# EAGLE design Regenmesser00 (EAGLE 5.04)
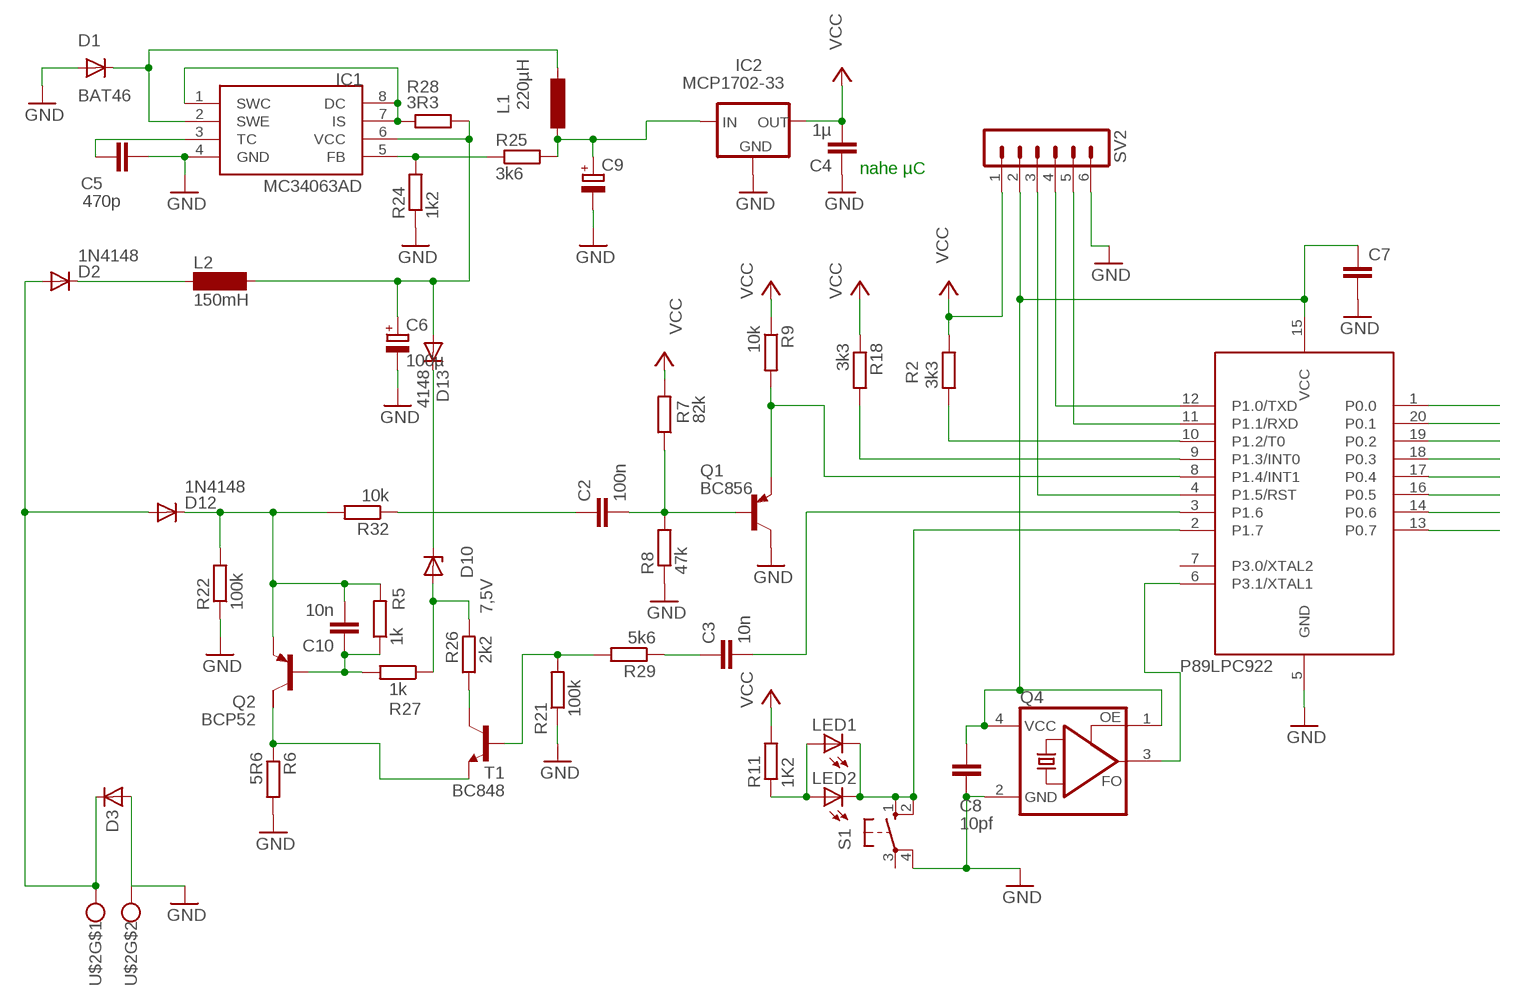
[diagram p0: schematic, sheet 1]

## Parts
C2  100n  C-EUC1206  [C1206]
C3  10n  C-EUC1206  [C1206]
C4  1µ  C-EUC1206  [C1206]
C5  470p  C-EUC1206  [C1206]
C6  100µ  CPOL-EUSANYO_SMD_B6  [SANYO-OSCON_SMD_B6]
C7  C-EUC1206  [C1206]
C8  10pf  C-EUC1206  [C1206]
C9  CPOL-EUSANYO_SMD_A5  [SANYO-OSCON_SMD_A5]
C10  10n  C-EUC1206  [C1206]
D1  BAT46  DIODE-MINIMELF  [MINIMELF]
D2  1N4148  DIODE-MINIMELF  [MINIMELF]
D3  SMAJ40AC  D-SMB  [SMB]
D10  7,5V  ZPD  [MINIMELF]
D12  1N4148  DIODE-MINIMELF  [MINIMELF]
D13  4148  DIODE-MINIMELF  [MINIMELF]
IC1  MC34063AD  [SOIC8]
IC2  MCP1702-33  79LXX  [79LXX]
L1  220µH  L-EU2200-11.43  [2200-11.43]
L2  150mH  SD12-1000  [SD12_1000]
LED1  LEDCHIPLED_1206  [CHIPLED_1206]
LED2  LED3MM  [LED3MM]
Q1  BC856  BC856ALT1SMD  [SOT23-BEC]
Q2  BCP52  FZT753SMD  [SOT223]
Q4  ASFL  [ASF]
R2  3k3  R-EU_M1206  [M1206]
R5  1k  R-EU_R1206  [R1206]
R6  5R6  R-EU_R1206  [R1206]
R7  82k  R-EU_R1206  [R1206]
R8  47k  R-EU_M1206  [M1206]
R9  10k  R-EU_R1206  [R1206]
R11  1K2  R-EU_R1206  [R1206]
R18  3k3  R-EU_R1206  [R1206]
R21  100k  R-EU_R1206  [R1206]
R22  100k  R-EU_M1206  [M1206]
R24  1k2  R-EU_R1206  [R1206]
R25  3k6  R-EU_M1206  [M1206]
R26  2k2  R-EU_M1206  [M1206]
R27  1k  R-EU_R1206  [R1206]
R28  3R3  R-EU_M1206  [M1206]
R29  5k6  R-EU_R1206  [R1206]
R32  10k  R-EU_R1206  [R1206]
S1  10-XX  [B3F-10XX]
SV2  MA06-1  [MA06-1]
T1  BC848  [SOT23]
U1  89LPC922  [DIL20]
U$2  AKL059-02  [AKL3.5X2]

## Nets
A_PUNKT_EIBIN: C2.2 Q1.B R7.1 R8.2
BASE_SEND: R21.2 R29.2 T1.1(B)
BASE_SEND_AMP: C10.1 Q2.1(B) R5.1 R27.2
C_T1: R26.1 T1.3(C)
CURR_SENSE: Q2.2(C) R6.1 T1.2(E)
EIB+: D2.A D3.1(C) D12.A U$2.1
EIB_DC1: C6.+ D13.A IC1.6(VCC) L2.2 R28.2
EIB_SEND: C3.2 U1.3(P1.6)
EIBIN: Q1.E R9.2 U1.8(P1.4/INT1)
GND: C4.1 C5.2 C6.- C7.2 C8.2 C9.- D1.A D3.2(A) IC1.4(GND) IC2.GND Q1.C Q4.2(GND) R6.2 R8.1 R21.1 R22.1 R24.1 S1.4(P1) SV2.6 U1.5(GND) U$2.2
INT0: R18.2 U1.9(P1.3/INT0)
N$2: C3.1 R29.1
N$5: C10.2 D12.C Q2.3(E) R5.2 R22.2 R32.2
N$8: D2.C L2.1
N$19: LED1.A LED2.A R11.1
N$51: D1.C IC1.2(SWE) L1.2
N$52: C5.1 IC1.3(TC)
N$58: D10.C D13.C
N$63: IC1.1(SWC) IC1.7(IS) IC1.8(DC) R28.1
N$77: C2.1 R32.1
OSCCLK: Q4.3(FO) U1.6(P3.1/XTAL1)
P00: U1.1(P0.0)
P01: U1.20(P0.1)
P02: U1.19(P0.2)
P03: U1.18(P0.3)
P04: U1.17(P0.4)
P05: U1.16(P0.5)
P06: U1.14(P0.6)
P07: U1.13(P0.7)
PROG: LED1.C LED2.K(C) S1.1(S) S1.2(S1) U1.2(P1.7)
PWM: R2.2 U1.10(P1.2/T0)
REFERENZ: D10.A R26.2 R27.1
RESET: SV2.3 U1.4(P1.5/RST)
RXD: SV2.5 U1.11(P1.1/RXD)
TXD: SV2.4 U1.12(P1.0/TXD)
VCC: C4.2 IC2.OUT R2.1 R7.2 R9.1 R11.2 R18.1 SV2.1
VCC5V: C9.+ IC2.IN L1.1 R25.2
VCC_FEEDBACK: IC1.5(FB) R24.2 R25.1
VCC_LPC: C7.1 C8.1 Q4.1(OE) Q4.4(VCC) SV2.2 U1.15(VCC)
Unconnected: Q2.4(C/) S1.3(P) U1.7(P3.0/XTAL2)

## Notes on the sheet
- nahe µC
- P89LPC922

## Library data of the parts
C2-C5 C7 C8 C10 = rcl:C-EU: CAPACITOR, European symbol
C6 C9 = rcl:CPOL-EU: POLARIZED CAPACITOR, European symbol
D1 D2 D12 D13 = diode:DIODE-: DIODE
D3 = semicon-smd-ipc:D-: DIODE unfilled
D10 = diode:ZPD: Z DIODE 500 mW
IC1 = mc34063:MC34063
IC2 = v-reg:79LXX: VOLTAGE REGULATOR
L1 = rcl:L-EU: INDUCTOR, European symbol
L2 = inductor-neosid:SD12: INDUCTOR nominal inductance
LED1 LED2 = led:LED: LED OSRAM: - CHIPLED LG R971, LG N971, LY N971, LG Q971, LY Q971, LO R971, LY R971 LH N974, LH R974 LS Q976, LO Q976, LY Q976 LO Q996 - Hyper CHIPLED LW Q18S LB Q993, LB Q99A, LB R99A - SideLED LS A670, LO A670, LY A670, LG A670, LP A670 LB A673, LV A673, LT A673, LW A673 LH A674 LY A675 LS A676, LA A676, LO A676, LY A676, LW A676 LS A679, LY A679, LG A679 - Hyper Micro SIDELED® LS Y876, LA Y876, LO Y876, LY Y876 LT Y87S - SmartLED LW L88C, LW L88S LB L89C, LB L89S, LG L890 LS L89K, LO L89K, LY L89K LS L896, LA L896, LO L896, LY L896 - TOPLED LS T670, LO T670, LY T670, LG T670, LP T670 LSG T670, LSP T670, LSY T670, LOP T670, LYG T670 LG T671, LOG T671, LSG T671 LB T673, LV T673, LT T673, LW T673 LH T674 LS T676, LA T676, LO T676, LY T676, LB T676, LH T676, LSB T676, LW T676 LB T67C, LV T67C, LT T67C, LS T67K, LO T67K, LY T67K, LW E67C LS E67B, LA E67B, LO E67B, LY E67B, LB E67C, LV E67C, LT E67C LW T67C LS T679, LY T679, LG T679 LS T770, LO T770, LY T770, LG T770, LP T770 LB T773, LV T773, LT T773, LW T773 LH T774 LS E675, LA E675, LY E675, LS T675 LS T776, LA T776, LO T776, LY T776, LB T776 LHGB T686 LT T68C, LB T68C - Hyper Mini TOPLED® LB M676 - Mini TOPLED Santana® LG M470 LS M47K, LO M47K, LY M47K Source: http://www.osram.convergy.de - LUMILED® LXK2-PW12-R00, LXK2-PW12-S00, LXK2-PW14-U00, LXK2-PW14-V00 LXK2-PM12-R00, LXK2-PM12-S00, LXK2-PM14-U00 LXK2-PE12-Q00, LXK2-PE12-R00, LXK2-PE12-S00, LXK2-PE14-T00, LXK2-PE14-U00 LXK2-PB12-K00, LXK2-PB12-L00, LXK2-PB12-M00, LXK2-PB14-N00, LXK2-PB14-P00, LXK2-PB14-Q00 LXK2-PR12-L00, LXK2-PR12-M00, LXK2-PR14-Q00, LXK2-PR14-R00 LXK2-PD12-Q00, LXK2-PD12-R00, LXK2-PD12-S00 LXK2-PH12-R00, LXK2-PH12-S00 LXK2-PL12-P00, LXK2-PL12-Q00, LXK2-PL12-R00 Source: www.luxeon.com
Q1 = transistor-pnp:BC856*: PNP Transistror
Q2 = transistor-pnp:FZT753SMD: PNP Transistor
Q4 = crystal:ASF*: CRYSTAL CLOCK OSCILLATORS 5.0 Vdc or 3.3 Vdc - LOW PROFILE ULTRA MINIATURE CERAMIC SURFACE MOUNT Source: http://www.abracon.com/Oscillators/asf1-L-L1.pdf
R2 R5-R9 R11 R18 R21 R22 R24-R29 R32 = rcl:R-EU_: RESISTOR, European symbol
S1 = switch-omron:10-XX: OMRON SWITCH
SV2 = con-lstb:MA06-1: PIN HEADER
T1 = transistor:BC848: NPN TRANSISTOR
U1 = micro-philips:89LPC922
U$2 = con-wago-500:AKL059-02

## Board
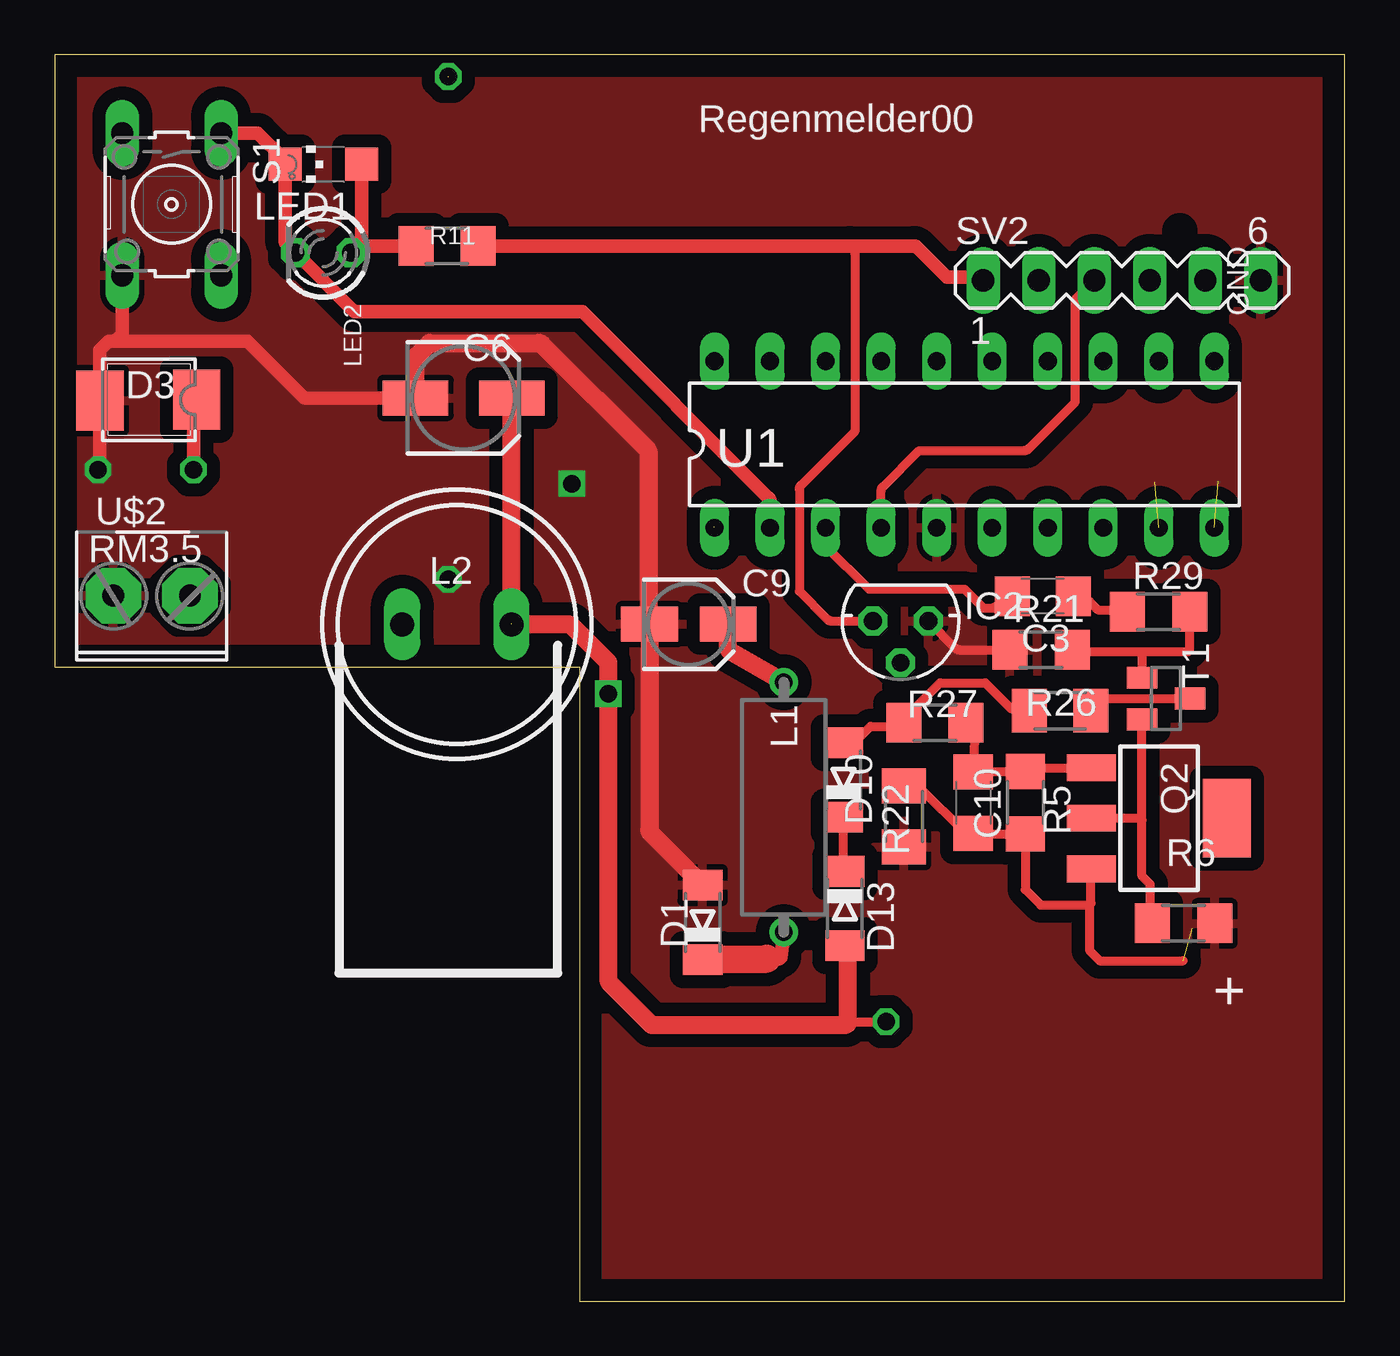
[diagram p1: board, top side]
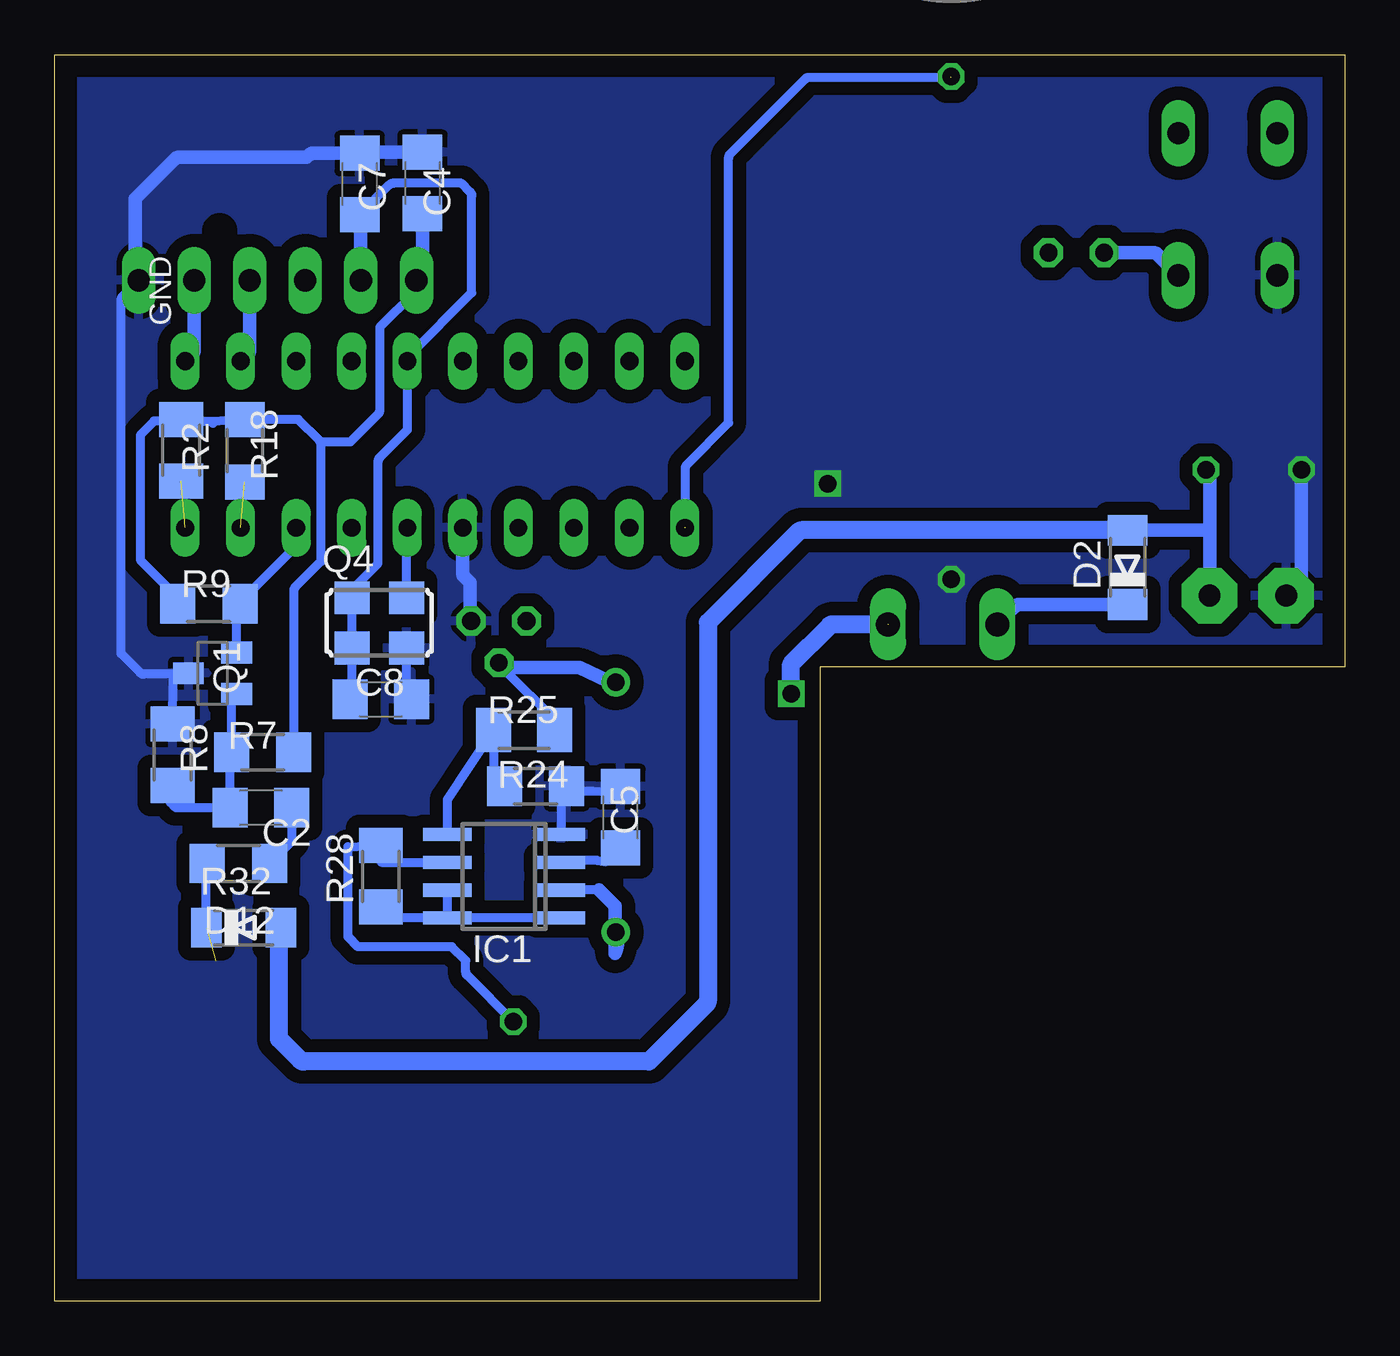
[diagram p2: board, bottom side, seen from below]

Size 59 x 57 mm. Coordinates in mm from the lower left corner, seen from the top.
Outline: 59,0 59,57 0,57 0,29 24,29 24,0 59,0
Copper layers (1*16): Top 0.035mm / dielectric 1.5mm / Bottom 0.035mm
Design rules "default": minimum track width 10mil, minimum drill 24mil, track to track 8mil, track to pad 8mil, pad to pad 8mil, via to via 8mil, smd to smd 8mil, copper to edge 40mil, drill to drill 8mil, minimum pad ring 10mil, minimum via ring 8mil, stop-mask expansion 4mil, vias tented up to drill 0mil, thermal gap 10mil
bKeepout: area 17,36 to 19,51
tRestrict: 2 lines
bRestrict: 1 lines

### Footprints (pad centres in the part's own frame; a part is rotated, then mirrored left to right if it is on the bottom)
C1206 = smd 1.6 x 1.8: 1 -1.4,0; 2 1.4,0
SANYO-OSCON_SMD_B6 = smd 3 x 1.6: + 2.2,0; - -2.2,0
SANYO-OSCON_SMD_A5 = smd 2.6 x 1.6: + 1.8,0; - -1.8,0
MINIMELF = smd 1.4 x 1.8: A 1.7,0; C -1.7,0
SMB = smd 2.159 x 2.743: 1 -2.311,-0.127; 2 2.108,-0.102
SOIC8 = smd 0.6 x 2.2: 1 -1.905,-2.6; 2 -0.635,-2.6; 3 0.635,-2.6; 4 1.905,-2.6; 5 1.905,2.6; 6 0.635,2.6; 7 -0.635,2.6; 8 -1.905,2.6
79LXX = drill 0.813 octagon: GND -1.27,0; IN 0,1.905; OUT 1.27,0
2200-11.43 = drill 0.8 pad 1.27 round: 1 -5.715,0; 2 5.715,0
SD12_1000 = drill 1.1 long: 1 -2.5,0; 2 2.5,0
CHIPLED_1206 = smd 1.5 x 1.5: A 0,-1.75; C 0,1.75
LED3MM = drill 0.813 octagon: A -1.27,0; K 1.27,0
SOT23-BEC = smd 1 x 1.4: B -0.95,-1.1; C 0,1.1; E 0.95,-1.1
SOT223 = smd 1.219 x 2.235: 1 -2.311,-3.099; 2 0,-3.099; 3 2.311,-3.099 | smd 3.6 x 2.2: 4 0,3.099
ASF = smd 1.6 x 1.5: 1 -1.25,-1.15; 2 1.25,-1.15; 3 1.25,1.15; 4 -1.25,1.15
M1206 = smd 1.6 x 2: 1 -1.4,0; 2 1.4,0
R1206 = smd 1.6 x 1.803: 1 -1.422,0; 2 1.422,0
B3F-10XX = drill 1.016 long: 1 -3.251,2.261; 2 3.251,2.261; 3 -3.251,-2.261; 4 3.251,-2.261
MA06-1 = drill 1.016 long: 1 -6.35,0; 2 -3.81,0; 3 -1.27,0; 4 1.27,0; 5 3.81,0; 6 6.35,0
SOT23 = smd 1 x 1.4: 1 -0.95,-1.1; 2 0.95,-1.1; 3 0,1.1
DIL20 = drill 0.813 long: 1 -11.43,-3.81; 2 -8.89,-3.81; 3 -6.35,-3.81; 4 -3.81,-3.81; 5 -1.27,-3.81; 6 1.27,-3.81; 7 3.81,-3.81; 8 6.35,-3.81; 9 8.89,-3.81; 10 11.43,-3.81; 11 11.43,3.81; 12 8.89,3.81; 13 6.35,3.81; 14 3.81,3.81; 15 1.27,3.81; 16 -1.27,3.81; 17 -3.81,3.81; 18 -6.35,3.81; 19 -8.89,3.81; 20 -11.43,3.81
AKL3.5X2 = drill 1 pad 2.54 octagon: 1 -1.75,-0.1; 2 1.75,-0.1

### Placement (x,y rotation side)
C2  49.57,22.56 180 bottom
C3  45.19,32.24 180 top
C4  42.18,51.14 270 bottom
C5  33.12,22.13 90 bottom
C6  18.7,41.3 0 top
C7  45.05,51.09 90 bottom
C8  44.08,27.52 0 bottom
C9  29,30.95 0 top
C10  42.01,22.79 270 top
D1  29.63,17.32 90 top
D2  9.94,33.56 90 bottom
D3  4.18,41.09 180 top
D10  36.07,23.84 90 top
D12  50.36,17.08 0 bottom
D13  36.14,17.95 270 top
IC1  38.44,19.43 90 bottom
IC2  38.68,31.1 180 top
L1  33.34,22.59 270 top
L2  18.39,30.95 0 top
LED1  12.29,51.99 90 top
LED2  12.28,47.94 180 top
Q1  51.78,28.71 90 bottom
Q2  50.5,22.08 270 top
Q4  44.16,31.02 0 bottom
R2  53.21,38.91 270 bottom
R5  44.39,22.79 270 top
R6  51.62,17.27 0 top
R7  49.49,25.1 0 bottom
R8  53.6,24.98 270 bottom
R9  51.94,31.88 0 bottom
R11  17.94,48.25 0 top
R18  50.31,38.88 270 bottom
R21  45.11,29.78 0 top
R22  38.84,22.16 90 top
R24  37.01,23.55 180 bottom
R25  37.54,26.11 0 bottom
R26  45.98,27 180 top
R27  40.25,26.46 0 top
R28  44.08,19.43 90 bottom
R29  50.48,31.52 0 top
R32  50.6,20.02 180 bottom
S1  5.35,50.16 270 top
SV2  48.81,46.68 0 top
T1  50.82,27.55 270 top
U1  41.61,39.17 0 top
U$2  4.43,32.16 180 top

### Tracks (layer width: path | path; a pad name or v marks a point on that pad's centre or on a via)
A_PUNKT_EIBIN
  Bottom 0.406: R8.2 53.7,23.52 53.7,22.79 53.46,22.55 C2.2 50.97,25.04 R7.1 50.91,27.53 Q1.B
BASE_SEND
  Top 0.406: R29.2 51.9,29.76 51.84,29.7 49.78,29.7 | 49.78,29.7 46.61,29.7 R21.2 | T1.1 49.72,29.64 49.78,29.7
BASE_SEND_AMP
  Top 0.406: Q2.1 44.57,24.39 R5.1 42.03,24.21 | C10.1 42.03,24.21 | 42.03,24.21 42.08,25.81 R27.2
C_T1
  Top 0.406: 47.3,27.16 R26.1 47.94,27.55 T1.3
CURR_SENSE
  Top 0.406: 49.72,22 T1.2 | Q2.2 49.64,22.08 49.72,22 | 49.72,22 49.72,19.44 50.1,19.06 50.1,17.4 R6.1
EIB+  (via drill 0.8)
  Top 0.61: D3.1 arc90 6.35,41.07 v6.35,38.02
  Bottom 0.61: v6.35,38.02 arc90 6.18,37.85 6.18,35.24 | U$2.1 6.18,35.24 | D2.A 6.2,35.26 arc90 6.18,35.24
  Bottom 0.813: D2.A 24.8,35.26 arc-45 24.98,35.18 29.13,31.04 29.13,13.76 arc45 29.2,13.58 31.83,10.95 47.6,10.95 arc45 47.78,11.03 48.74,11.99 48.74,16.9 arc45 D12.A
EIB_DC1  (via drill 0.8)  (1 unrouted)
  Top 0.406: v38.02,12.78 36.46,12.78 arc45 36.28,12.71 36.27,12.7
  Top 0.813: C6.+ L2.2 arc-45 L2.2 23.48,30.95 arc-45 23.66,30.87 25.32,29.21 v25.32,27.78 25.32,14.71 arc45 25.39,14.53 27.3,12.62 36.09,12.62 arc45 36.27,12.7 36.27,16.01 arc45 36.2,16.19 D13.A
  Bottom 0.406: IC1.6 44.05,20.06 R28.2 44.27,20.83 45.59,20.78 45.59,16.67 45.12,16.2 40.84,16.2 40.2,15.57 40.2,15.07 arc-45 40.13,14.89 v38.02,12.78
  Bottom 0.813: 25.32,27.86 25.32,29.13 23.57,30.88 arc45 23.39,30.96 20.88,30.96
EIB_SEND
  Top 0.406: U1.3 35.26,34.54 37.24,32.56 41.6,32.56 42.48,31.68 42.91,31.68 C3.2
EIBIN
  Bottom 0.406: Q1.E 50.68,31.73 R9.2 50.52,32.27 50.3,32.27 arc-45 50.12,32.35 48.02,34.45 48.02,35.2 arc45 U1.8
GND  (via drill 0.8)
  Top 0.406: 43.84,29.22 R21.1 41.38,29.78 arc-45 41.2,29.85 IC2.GND
  Top 0.61: v1.98,38.02 arc90 2.07,38.11 D3.2 arc-45 2.06,41.21 2.06,43.5 2.39,43.82 arc-45 2.57,43.89 2.78,43.89 | C6.- 11.51,41.3 arc-45 11.33,41.38 8.81,43.89 2.78,43.89 | S1.4 3.09,44.31 arc-45 3.02,44.13 2.78,43.89
  Top 0.813: C6.- 16.5,43.06 arc-45 16.57,43.24 17.14,43.81 22.12,43.81 arc-45 22.3,43.74 27.15,38.89 27.15,31.09 arc45 C9.- 27.2,21.56 arc45 27.28,21.38 D1.A
  Bottom 0.406: C5.2 33.49,23.29 34.39,23.32 35.67,23.32 R24.1 | IC1.4 35.84,23.3 R24.1 | R24.1 36.06,23.71 | R8.1 53.58,28.44 53.44,28.67 | 53.44,28.67 52.92,28.67 Q1.C | 53.44,28.67 54.91,28.67 arc45 55.09,28.74 55.96,29.61 55.96,45.77 arc45 55.88,45.95 SV2.6 | Q4.2 42.91,27.75 C8.2
  Bottom 0.61: U$2.2 2.24,32.26 arc-90 1.98,32.51 v1.98,38.02 | C4.1 44.95,52.54 arc-45 C7.2 47.17,52.49 arc-45 47.35,52.42 47.47,52.31 53.31,52.31 arc-45 53.49,52.23 55.32,50.4 55.32,46.95 arc-45 55.25,46.77 SV2.6 | U1.5 40.34,33.3 arc-45 40.26,33.12 40.01,32.86 40.01,31.22 arc-45 IC2.GND
  other vias: 18,33 23.65,37.39
  pour Bottom (isolate 0.61): -1.03,58.9 -0.47,59.46 arc-45 -0.29,59.53 60.25,59.53 63.66,56.11 arc-45 63.74,55.93 63.74,-1.98 63.65,-2.07 arc-45 63.47,-2.14 -2.14,-2.14
  pour Top (isolate 0.61): -2.06,60.4 -1.5,60.97 arc-45 -1.32,61.04 65.01,61.04 65.33,60.72 arc-45 65.41,60.54 65.41,-2.46 64.84,-3.02 arc-45 64.66,-3.1 -2.22,-3.1 -2.22,-2.86 -2.39,-2.69 arc-45 -2.46,-2.51 -2.46,49.13
INT0  (1 unrouted)
N$2
  Top 0.406: C3.1 47.32,32 47.72,31.6 48.98,31.6 R29.1
N$5  (1 unrouted)
  Top 0.406: Q2.3 47.4,19.78 47.4,18.19 47.32,18.11 | 47.32,18.11 45.1,18.11 44.38,18.82 44.38,20.87 44.39,20.88 R5.2 42.04,21.36 C10.2 41.73,21.31 39.46,23.59 38.73,23.67 R22.2 | 47.32,18.11 47.32,16.04 47.79,15.57 51.6,15.57
  Bottom 0.406: R32.2 52.27,20.02 52.06,19.9 D12.C 52.03,17.05
N$8
  Bottom 0.61: D2.C 14.88,31.86 arc-45 15.06,31.78 L2.1
N$19
  Top 0.61: LED1.A 14.04,48.53 arc-45 13.96,48.35 | LED2.A 13.96,48.35 | R11.1 14.17,48.25 arc-45 13.99,48.33 13.96,48.35
N$51
  Top 0.61: 32.55,15.65 33.05,15.65 arc45 33.23,15.72 L1.2
  Top 1.27: D1.C 32.55,15.65
  Bottom 0.406: 34.1,18.79 IC1.2
  Bottom 0.61: 34.1,18.79 33.37,18.06 33.37,15.91 arc-45 L1.2
N$52
  Bottom 0.406: C5.1 33.79,20.09 34.16,20.14 35.76,20.14 IC1.3
N$58
  Top 0.406: 36.05,19.74 D13.C 36.07,19.72 D10.C
N$63
  Bottom 0.406: IC1.8 43.63,17.52 R28.1 | IC1.8 IC1.7 | IC1.1 IC1.8
N$77
  Bottom 0.406: C2.1 48.17,21.02 R32.1
OSCCLK
  Bottom 0.406: Q4.3 42.91,35.29 arc45 U1.6
P00  (via drill 0.8)  (2 unrouted)
  Bottom 0.406: 18.02,55.96 24.5,55.96 arc-45 24.68,55.88 28.1,52.46 arc-45 28.18,52.28 28.18,40.16 30.09,38.25 arc-45 30.16,38.07 30.16,35.4
  other vias: 18,56
PROG
  Top 0.61: S1.1 arc-45 7.63,53.42 9.29,53.42 10.46,52.24 arc-45 10.54,52.06 LED1.C 10.54,48.52 arc45 10.61,48.34 LED2.K 13.63,45.32 arc45 13.81,45.24 24.13,45.24 32.64,36.73 arc-45 32.72,36.55 U1.2 32.7,35.35 arc45 32.62,35.17
  Bottom 0.61: LED2.K 8.75,47.94 arc45 8.57,47.87 S1.2
PWM  (1 unrouted)
REFERENZ
  Top 0.406: D10.A 36.57,25.54 37.32,26.29 38.82,26.29 R27.1 38.83,26.61 40.49,28.27 42.56,28.27 43.75,27.08 44.5,27.08 R26.2
RESET
  Top 0.406: U1.4 37.8,37.06 arc-45 37.87,37.23 39.53,38.89 44.34,38.89 arc45 44.52,38.97 46.67,41.12 46.67,45.71 arc-45 46.75,45.89 SV2.3
RXD
  Bottom 0.61: SV2.5 52.62,43.51 arc45 52.69,43.33 U1.11
TXD
  Bottom 0.61: SV2.4 50.08,43.51 arc45 50.15,43.33 U1.12
VCC
  Top 0.406: IC2.OUT 35.52,31.1 arc-45 35.35,31.17 34.05,32.46 34.05,37.12 arc-45 34.13,37.3 36.59,39.77 36.59,47.91 arc45 36.52,48.09 36.35,48.25
  Top 0.61: R11.2 36.35,48.25 39.27,48.25 arc-45 39.45,48.18 40.8,46.83 42.2,46.83 arc-45 42.38,46.76 SV2.1
  Bottom 0.406: 51.84,40.23 R18.1 arc45 50.27,40.32 47.86,40.32 46.91,39.37 arc45 46.83,39.19 | 51.84,40.23 53.37,40.23 R2.1 arc45 53.37,40.24 54.45,40.24 55.01,39.68 arc-45 55.09,39.5 55.09,33.89 53.44,32.25 arc45 53.37,32.07 R9.1 53.37,31.93 | 51.84,40.23 51.76,40.15 | R7.2 48.07,32.47 arc45 47.99,32.65 46.83,33.81 46.83,39.19 | SV2.1 42.46,46.31 arc45 42.53,46.13 44.13,44.53 44.13,40.74 arc45 44.21,40.57 45.48,39.29 46.62,39.29 arc-45 46.8,39.22 46.83,39.19
  Bottom 0.61: C4.2 42.18,47.06 arc45 42.26,46.88 SV2.1
VCC5V
  Top 0.813: C9.+ 30.8,29.91 arc45 30.88,29.73 L1.1
  Bottom 0.406: R25.2 35.9,26.35 38.69,29.14 38.69,29.41
  Bottom 0.61: 38.69,29.14 38.69,29.17 arc45 IC2.IN 38.54,29.05 arc-45 38.36,28.97 35,28.97 33.69,28.37 arc45 L1.1
VCC_FEEDBACK
  Bottom 0.406: IC1.5 41.04,22.93 R25.1 38.94,23.58 R24.2
VCC_LPC
  Bottom 0.406: C8.1 45.41,27.91 Q4.1 Q4.4 45.41,32.43 arc45 45.33,32.61 44.21,33.73 44.21,38.39 arc45 44.14,38.57 42.86,39.85 42.86,42.95 arc-45 U1.15 42.88,43.06 arc45 42.8,43.24 39.93,46.12 39.93,50.54 arc-45 40,50.72 40.4,51.12 43.52,51.12 arc-45 43.7,51.04 C7.1
  Bottom 0.61: SV2.2 45,49.58 arc-45 C7.1

### Text on the board
tPlace: Regenmelder00 | GND | +
bPlace: GND
bStop: CC | V